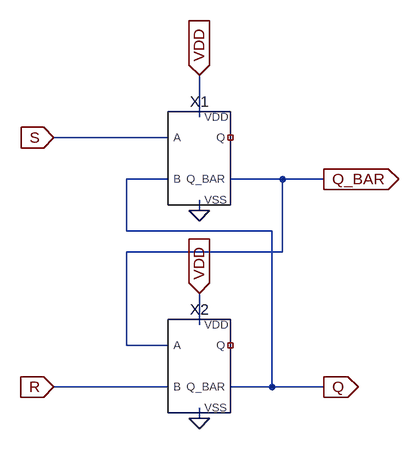
[diagram p0: schematic my_sr_latch.asc]
my_sr_latch.asc, the LTspice schematic file:
Version 4
SHEET 1 880 680
WIRE 192 128 192 64
WIRE 144 160 -32 160
WIRE 144 224 80 224
WIRE 320 224 240 224
WIRE 384 224 320 224
WIRE 192 272 192 256
WIRE 80 304 80 224
WIRE 304 304 80 304
WIRE 320 336 320 224
WIRE 320 336 80 336
WIRE 192 448 192 400
WIRE 80 480 80 336
WIRE 144 480 80 480
WIRE 144 544 -32 544
WIRE 304 544 304 304
WIRE 304 544 240 544
WIRE 384 544 304 544
WIRE 192 592 192 576
FLAG 192 64 VDD
IOPIN 192 64 In
FLAG 192 400 VDD
IOPIN 192 400 In
FLAG 192 272 0
FLAG 192 592 0
FLAG -32 160 S
IOPIN -32 160 In
FLAG -32 544 R
IOPIN -32 544 In
FLAG 384 224 Q_BAR
IOPIN 384 224 Out
FLAG 384 544 Q
IOPIN 384 544 Out
SYMBOL my_cmos_or 192 192 R0
SYMATTR InstName X1
SYMBOL my_cmos_or 192 512 R0
SYMATTR InstName X2

The netlist it stands for:
* my_sr_latch.asc
XX1 S Q VDD 0 NC_01 Q_BAR my_cmos_or  ; pins A B VDD VSS Q Q_BAR
XX2 Q_BAR R VDD 0 NC_02 Q my_cmos_or  ; pins A B VDD VSS Q Q_BAR
.backanno
.end